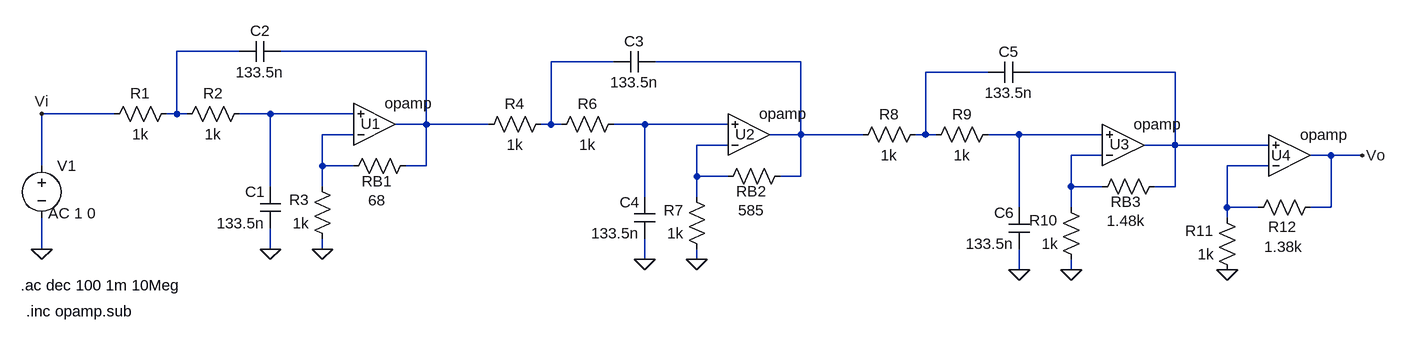
[diagram p0: schematic Ej_3a.asc]
Ej_3a.asc, the LTspice schematic file:
Version 4
SHEET 1 1880 680
WIRE -96 16 -192 16
WIRE 192 16 -32 16
WIRE 480 32 384 32
WIRE 768 32 544 32
WIRE 1056 48 960 48
WIRE 1344 48 1120 48
WIRE -288 112 -400 112
WIRE -192 112 -192 16
WIRE -192 112 -208 112
WIRE -176 112 -192 112
WIRE -48 112 -96 112
WIRE 80 112 -48 112
WIRE 192 128 192 16
WIRE 192 128 144 128
WIRE 288 128 192 128
WIRE 384 128 384 32
WIRE 384 128 368 128
WIRE 400 128 384 128
WIRE 528 128 480 128
WIRE 656 128 528 128
WIRE 80 144 32 144
WIRE 768 144 768 32
WIRE 768 144 720 144
WIRE 864 144 768 144
WIRE 960 144 960 48
WIRE 960 144 944 144
WIRE 976 144 960 144
WIRE 1104 144 1056 144
WIRE 1232 144 1104 144
WIRE 656 160 608 160
WIRE 1344 160 1344 48
WIRE 1344 160 1296 160
WIRE 1488 160 1344 160
WIRE 1232 176 1184 176
WIRE 1584 176 1552 176
WIRE 1632 176 1584 176
WIRE -400 192 -400 112
WIRE 32 192 32 144
WIRE 80 192 32 192
WIRE 192 192 192 128
WIRE 192 192 160 192
WIRE 1488 192 1424 192
WIRE 608 208 608 160
WIRE 656 208 608 208
WIRE 768 208 768 144
WIRE 768 208 736 208
WIRE -48 224 -48 112
WIRE 32 224 32 192
WIRE 1184 224 1184 176
WIRE 1232 224 1184 224
WIRE 1344 224 1344 160
WIRE 1344 224 1312 224
WIRE 528 240 528 128
WIRE 608 240 608 208
WIRE 1104 256 1104 144
WIRE 1184 256 1184 224
WIRE 1424 256 1424 192
WIRE 1472 256 1424 256
WIRE 1584 256 1584 176
WIRE 1584 256 1552 256
WIRE 1424 272 1424 256
WIRE -400 320 -400 272
WIRE -48 320 -48 288
WIRE 32 320 32 304
WIRE 528 336 528 304
WIRE 608 336 608 320
WIRE 1104 352 1104 320
WIRE 1184 352 1184 336
FLAG -48 320 0
FLAG 32 320 0
FLAG 1424 352 0
FLAG 1632 176 Vo
FLAG -400 112 Vi
FLAG -400 320 0
FLAG 528 336 0
FLAG 608 336 0
FLAG 1104 352 0
FLAG 1184 352 0
SYMBOL OpAmps\\opamp 112 192 M180
WINDOW 0 -21 65 Left 2
SYMATTR InstName U1
SYMBOL OpAmps\\opamp 1520 240 M180
WINDOW 0 -28 64 Left 2
SYMATTR InstName U4
SYMBOL cap -32 0 R90
WINDOW 0 0 32 VBottom 2
WINDOW 3 32 32 VTop 2
SYMATTR InstName C2
SYMATTR Value 133.5n
SYMBOL cap -32 288 R180
WINDOW 0 24 56 Left 2
WINDOW 3 24 8 Left 2
SYMATTR InstName C1
SYMATTR Value 133.5n
SYMBOL res -192 96 R90
WINDOW 0 0 56 VBottom 2
WINDOW 3 32 56 VTop 2
SYMATTR InstName R1
SYMATTR Value 1k
SYMBOL res -80 96 R90
WINDOW 0 0 56 VBottom 2
WINDOW 3 32 56 VTop 2
SYMATTR InstName R2
SYMATTR Value 1k
SYMBOL res 176 176 R90
WINDOW 0 55 60 VBottom 2
WINDOW 3 53 60 VTop 2
SYMATTR InstName RB1
SYMATTR Value 68
SYMBOL res 48 320 R180
WINDOW 0 36 76 Left 2
WINDOW 3 36 40 Left 2
SYMATTR InstName R3
SYMATTR Value 1k
SYMBOL res 1440 368 R180
WINDOW 0 36 76 Left 2
WINDOW 3 36 40 Left 2
SYMATTR InstName R11
SYMATTR Value 1k
SYMBOL res 1456 272 R270
WINDOW 0 -29 53 VTop 2
WINDOW 3 -29 55 VBottom 2
SYMATTR InstName R12
SYMATTR Value 1.38k
SYMBOL voltage -400 176 R0
WINDOW 123 10 89 Left 2
WINDOW 39 0 0 Left 0
SYMATTR Value2 AC 1 0
SYMATTR InstName V1
SYMATTR Value ""
SYMBOL OpAmps\\opamp 688 208 M180
WINDOW 0 -21 65 Left 2
SYMATTR InstName U2
SYMBOL cap 544 16 R90
WINDOW 0 0 32 VBottom 2
WINDOW 3 32 32 VTop 2
SYMATTR InstName C3
SYMATTR Value 133.5n
SYMBOL cap 544 304 R180
WINDOW 0 24 56 Left 2
WINDOW 3 24 8 Left 2
SYMATTR InstName C4
SYMATTR Value 133.5n
SYMBOL res 384 112 R90
WINDOW 0 0 56 VBottom 2
WINDOW 3 32 56 VTop 2
SYMATTR InstName R4
SYMATTR Value 1k
SYMBOL res 496 112 R90
WINDOW 0 0 56 VBottom 2
WINDOW 3 32 56 VTop 2
SYMATTR InstName R6
SYMATTR Value 1k
SYMBOL res 752 192 R90
WINDOW 0 55 60 VBottom 2
WINDOW 3 53 60 VTop 2
SYMATTR InstName RB2
SYMATTR Value 585
SYMBOL res 624 336 R180
WINDOW 0 36 76 Left 2
WINDOW 3 36 40 Left 2
SYMATTR InstName R7
SYMATTR Value 1k
SYMBOL OpAmps\\opamp 1264 224 M180
WINDOW 0 -21 65 Left 2
SYMATTR InstName U3
SYMBOL cap 1120 32 R90
WINDOW 0 0 32 VBottom 2
WINDOW 3 32 32 VTop 2
SYMATTR InstName C5
SYMATTR Value 133.5n
SYMBOL cap 1120 320 R180
WINDOW 0 24 56 Left 2
WINDOW 3 24 8 Left 2
SYMATTR InstName C6
SYMATTR Value 133.5n
SYMBOL res 960 128 R90
WINDOW 0 0 56 VBottom 2
WINDOW 3 32 56 VTop 2
SYMATTR InstName R8
SYMATTR Value 1k
SYMBOL res 1072 128 R90
WINDOW 0 0 56 VBottom 2
WINDOW 3 32 56 VTop 2
SYMATTR InstName R9
SYMATTR Value 1k
SYMBOL res 1328 208 R90
WINDOW 0 55 60 VBottom 2
WINDOW 3 53 60 VTop 2
SYMATTR InstName RB3
SYMATTR Value 1.48k
SYMBOL res 1200 352 R180
WINDOW 0 36 76 Left 2
WINDOW 3 36 40 Left 2
SYMATTR InstName R10
SYMATTR Value 1k
TEXT -432 376 Left 2 !.ac dec 100 1m 10Meg
TEXT -424 416 Left 2 !.inc opamp.sub

The netlist it stands for:
* Ej_3a.asc
XU1 N009 N007 N002 opamp Aol=100K GBW=10Meg  ; pins invin noninvin out
XU4 N013 N006 Vo opamp Aol=100K GBW=10Meg  ; pins invin noninvin out
C2 N002 N001 133.5n
C1 0 N007 133.5n
R1 N001 Vi 1k
R2 N007 N001 1k
RB1 N002 N009 68
R3 0 N009 1k
R11 0 N013 1k
R12 N013 Vo 1.38k
V1 Vi 0 AC 1 0
XU2 N011 N008 N004 opamp Aol=100K GBW=10Meg  ; pins invin noninvin out
C3 N004 N003 133.5n
C4 0 N008 133.5n
R4 N003 N002 1k
R6 N008 N003 1k
RB2 N004 N011 585
R7 0 N011 1k
XU3 N012 N010 N006 opamp Aol=100K GBW=10Meg  ; pins invin noninvin out
C5 N006 N005 133.5n
C6 0 N010 133.5n
R8 N005 N004 1k
R9 N010 N005 1k
RB3 N006 N012 1.48k
R10 0 N012 1k
.ac dec 100 1m 10Meg
.inc opamp.sub
.backanno
.end